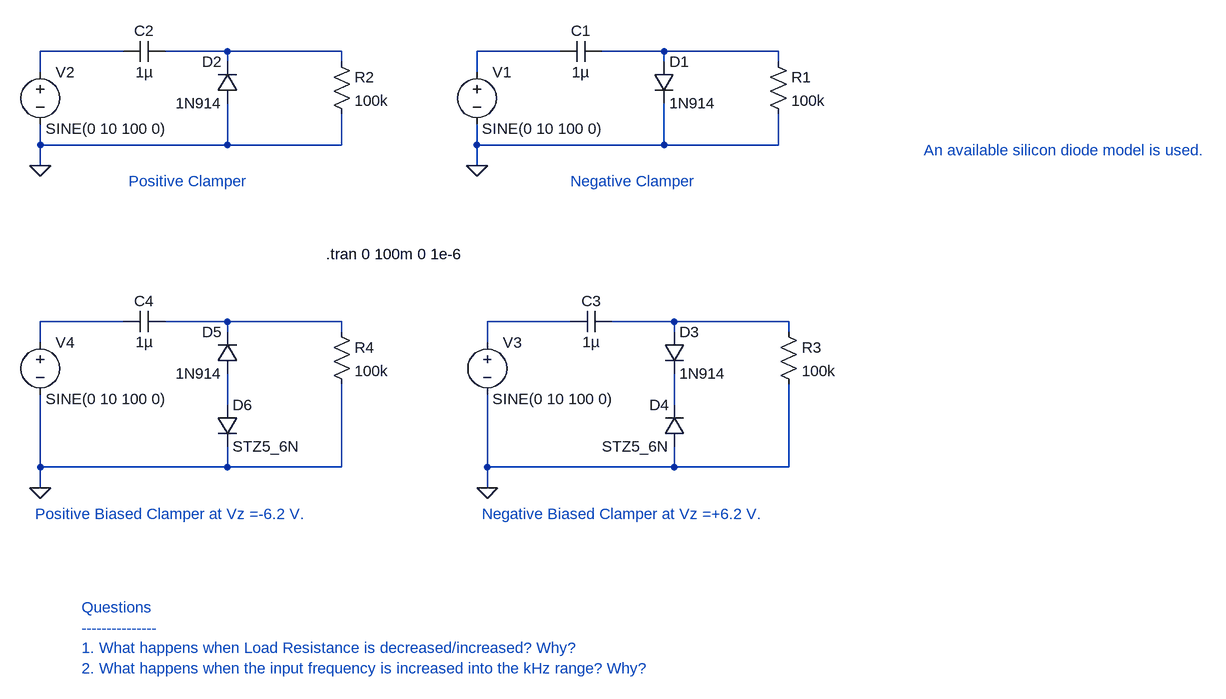
[diagram p0: schematic Demo_ClampingCircuits.asc]
Demo_ClampingCircuits.asc, the LTspice schematic file:
Version 4.1
SHEET 1 1680 1088
WIRE -560 112 -688 112
WIRE -400 112 -496 112
WIRE -224 112 -400 112
WIRE 112 112 -16 112
WIRE 272 112 176 112
WIRE 448 112 272 112
WIRE -400 128 -400 112
WIRE -224 128 -224 112
WIRE 272 128 272 112
WIRE 448 128 448 112
WIRE -688 144 -688 112
WIRE -16 144 -16 112
WIRE -688 256 -688 224
WIRE -400 256 -400 192
WIRE -400 256 -688 256
WIRE -224 256 -224 208
WIRE -224 256 -400 256
WIRE -16 256 -16 224
WIRE 272 256 272 192
WIRE 272 256 -16 256
WIRE 448 256 448 208
WIRE 448 256 272 256
WIRE -688 288 -688 256
WIRE -16 288 -16 256
WIRE -560 528 -688 528
WIRE -400 528 -496 528
WIRE -224 528 -400 528
WIRE 128 528 0 528
WIRE 288 528 192 528
WIRE 464 528 288 528
WIRE -400 544 -400 528
WIRE -224 544 -224 528
WIRE 288 544 288 528
WIRE 464 544 464 528
WIRE -688 560 -688 528
WIRE 0 560 0 528
WIRE -400 656 -400 608
WIRE 288 656 288 608
WIRE -688 752 -688 640
WIRE -400 752 -400 720
WIRE -400 752 -688 752
WIRE -224 752 -224 624
WIRE -224 752 -400 752
WIRE 0 752 0 640
WIRE 288 752 288 720
WIRE 288 752 0 752
WIRE 464 752 464 624
WIRE 464 752 288 752
WIRE -688 784 -688 752
WIRE 0 784 0 752
FLAG -16 288 0
FLAG -688 288 0
FLAG 0 784 0
FLAG -688 784 0
SYMBOL diode 256 128 R0
SYMATTR InstName D1
SYMATTR Value 1N914
SYMBOL cap 112 128 R270
WINDOW 0 32 32 VTop 2
WINDOW 3 0 32 VBottom 2
SYMATTR InstName C1
SYMATTR Value 1µ
SYMBOL voltage -16 128 R0
WINDOW 3 8 103 Left 2
WINDOW 123 0 0 Left 0
WINDOW 39 0 0 Left 0
SYMATTR InstName V1
SYMATTR Value SINE(0 10 100 0)
SYMBOL res 432 112 R0
SYMATTR InstName R1
SYMATTR Value 100k
SYMBOL diode -384 192 R180
WINDOW 0 24 64 Left 2
WINDOW 3 24 0 Left 2
SYMATTR InstName D2
SYMATTR Value 1N914
SYMBOL cap -560 128 R270
WINDOW 0 32 32 VTop 2
WINDOW 3 0 32 VBottom 2
SYMATTR InstName C2
SYMATTR Value 1µ
SYMBOL voltage -688 128 R0
WINDOW 3 8 103 Left 2
WINDOW 123 0 0 Left 0
WINDOW 39 0 0 Left 0
SYMATTR InstName V2
SYMATTR Value SINE(0 10 100 0)
SYMBOL res -240 112 R0
SYMATTR InstName R2
SYMATTR Value 100k
SYMBOL diode 272 544 R0
SYMATTR InstName D3
SYMATTR Value 1N914
SYMBOL cap 128 544 R270
WINDOW 0 32 32 VTop 2
WINDOW 3 0 32 VBottom 2
SYMATTR InstName C3
SYMATTR Value 1µ
SYMBOL voltage 0 544 R0
WINDOW 3 8 103 Left 2
WINDOW 123 0 0 Left 0
WINDOW 39 0 0 Left 0
SYMATTR InstName V3
SYMATTR Value SINE(0 10 100 0)
SYMBOL res 448 528 R0
SYMATTR InstName R3
SYMATTR Value 100k
SYMBOL diode 304 720 R180
WINDOW 0 24 64 Left 2
WINDOW 3 24 0 Left 2
SYMATTR InstName D4
SYMATTR Value STZ5_6N
SYMATTR Description Diode
SYMATTR Type diode
SYMBOL diode -384 608 R180
WINDOW 0 24 64 Left 2
WINDOW 3 24 0 Left 2
SYMATTR InstName D5
SYMATTR Value 1N914
SYMBOL cap -560 544 R270
WINDOW 0 32 32 VTop 2
WINDOW 3 0 32 VBottom 2
SYMATTR InstName C4
SYMATTR Value 1µ
SYMBOL voltage -688 544 R0
WINDOW 3 8 103 Left 2
WINDOW 123 0 0 Left 0
WINDOW 39 0 0 Left 0
SYMATTR InstName V4
SYMATTR Value SINE(0 10 100 0)
SYMBOL res -240 528 R0
SYMATTR InstName R4
SYMATTR Value 100k
SYMBOL diode -416 656 R0
SYMATTR InstName D6
SYMATTR Value STZ5_6N
SYMATTR Description Diode
SYMATTR Type diode
TEXT -248 424 Left 2 !.tran 0 100m 0 1e-6
TEXT -552 312 Left 2 ;Positive Clamper
TEXT 128 312 Left 2 ;Negative Clamper
TEXT -8 824 Left 2 ;Negative Biased Clamper at Vz =+6.2 V.
TEXT -696 824 Left 2 ;Positive Biased Clamper at Vz =-6.2 V.
TEXT -624 968 Left 2 ;Questions\n---------------\n1. What happens when Load Resistance is decreased/increased? Why?\n2. What happens when the input frequency is increased into the kHz range? Why?
TEXT 672 264 Left 2 ;An available silicon diode model is used.

The netlist it stands for:
* Demo_ClampingCircuits.asc
D1 N004 0 1N914
C1 N003 N004 1µ
V1 N003 0 SINE(0 10 100 0)
R1 N004 0 100k
D2 0 N002 1N914
C2 N001 N002 1µ
V2 N001 0 SINE(0 10 100 0)
R2 N002 0 100k
D3 N008 N010 1N914
C3 N007 N008 1µ
V3 N007 0 SINE(0 10 100 0)
R3 N008 0 100k
D4 0 N010 STZ5_6N
D5 N009 N006 1N914
C4 N005 N006 1µ
V4 N005 0 SINE(0 10 100 0)
R4 N006 0 100k
D6 N009 0 STZ5_6N
.model D D
.lib standard.dio
.tran 0 100m 0 1e-6
* Positive Clamper
* Negative Clamper
* Negative Biased Clamper at Vz =+6.2 V.
* Positive Biased Clamper at Vz =-6.2 V.
* Questions
* ---------------
* 1. What happens when Load Resistance is decreased/increased? Why?
* 2. What happens when the input frequency is increased into the kHz range? Why?
* An available silicon diode model is used.
.backanno
.end